# Altium schematic sheet FSR.SchDoc: Arm - Claw Sensor
size Letter; DrawnBy: N. Chapman, A. Ebrahim, K.Hong; Organization: UW Robotics; Address1: 200 University Avenue; Address2: Waterloo; Address3: Ontario; Address4: Canada N2L 3G6; SheetNumber: 7; SheetTotal: 9
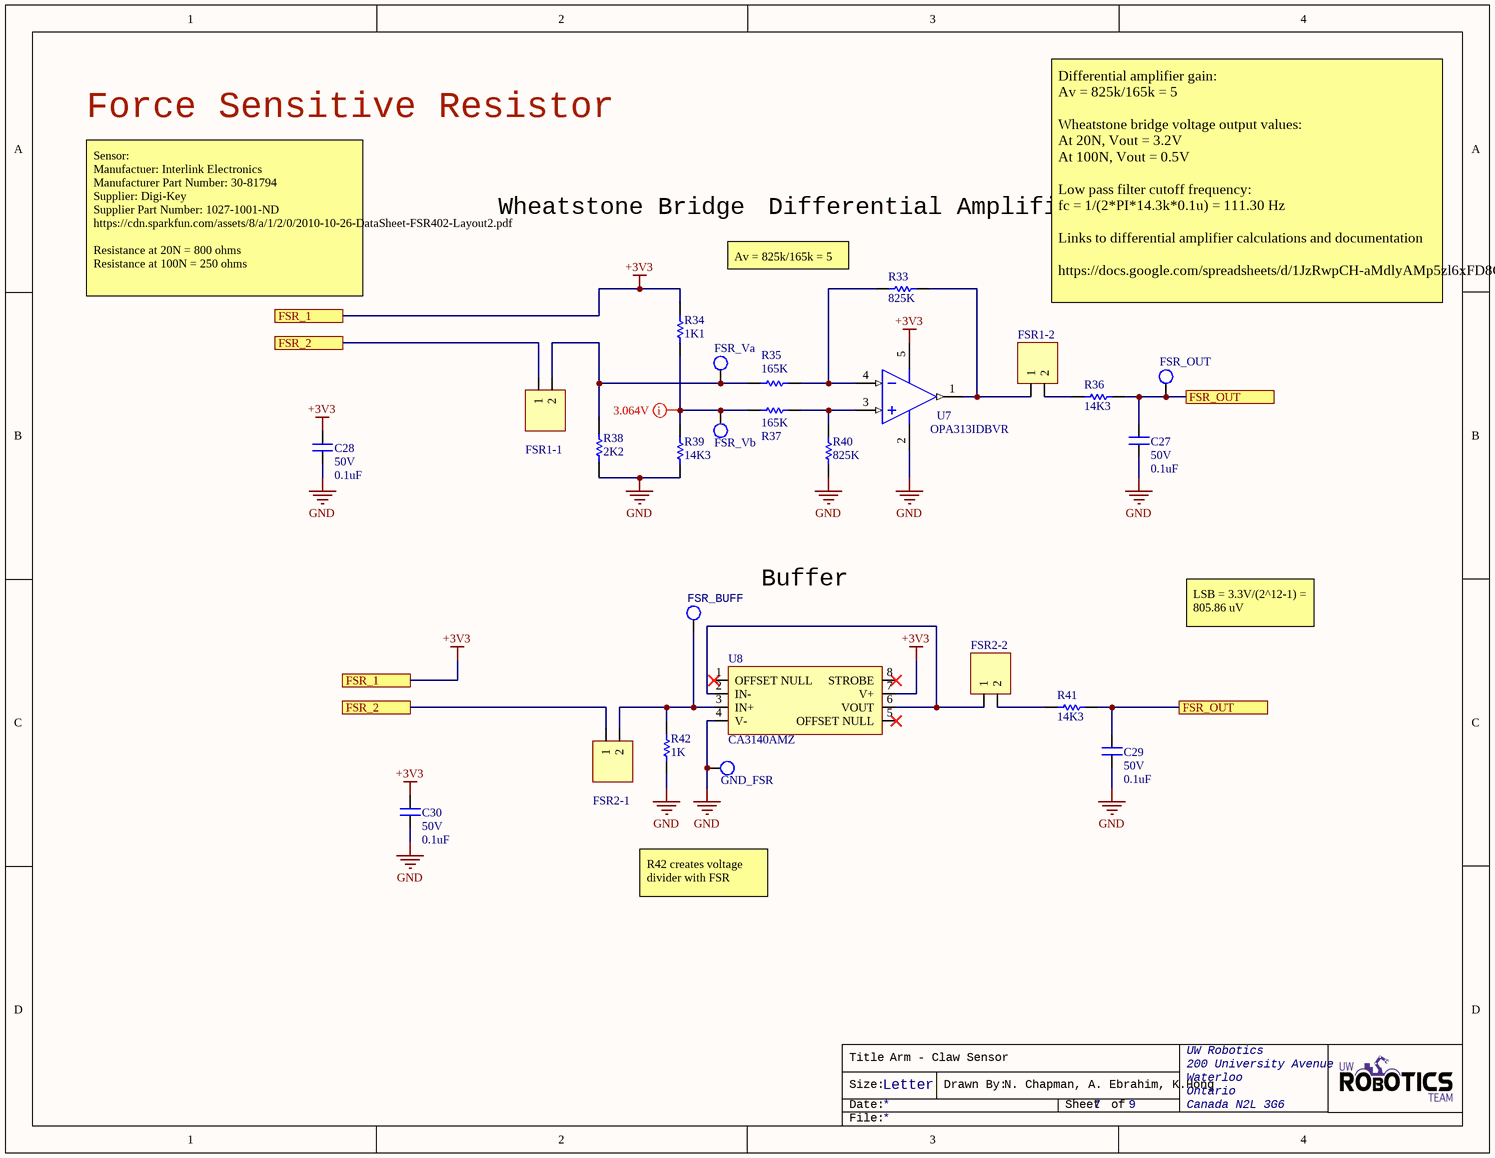
[diagram p0: FSR.SchDoc]

## Parts
C27  value 0.1uF  Voltage Rating: 50V  [CAPC0603(1608)55_N]  (hidden comment: CAP_0.1uF_50V_0603)
C28  value 0.1uF  Voltage Rating: 50V  [CAPC0603(1608)55_N]  (hidden comment: CAP_0.1uF_50V_0603)
C29  value 0.1uF  Voltage Rating: 50V  [CAPC0603(1608)55_N]  (hidden comment: CAP_0.1uF_50V_0603)
C30  value 0.1uF  Voltage Rating: 50V  [CAPC0603(1608)55_N]  (hidden comment: CAP_0.1uF_50V_0603)
FSR1-1  JUMPER_2  [HDR1X2]  (value not drawn)
FSR1-2  JUMPER_2  [HDR1X2]  (value not drawn)
FSR2-1  JUMPER_2  [HDR1X2]  (value not drawn)
FSR2-2  JUMPER_2  [HDR1X2]  (value not drawn)
FSR_BUFF  TESTPOINT_LOOP  [TESTPOINT_LOOP]  (value not drawn)
FSR_OUT  TESTPOINT_LOOP  [TESTPOINT_LOOP]  (value not drawn)
FSR_Va  TESTPOINT_LOOP  [TESTPOINT_LOOP]  (value not drawn)
FSR_Vb  TESTPOINT_LOOP  [TESTPOINT_LOOP]  (value not drawn)
GND_FSR  TESTPOINT_LOOP  [TESTPOINT_LOOP]  (value not drawn)
R33  value 825K  [RESC0603(1608)_N]  (hidden comment: RES_825K_0603)
R34  value 1K1  [RESC0603(1608)_N]  (hidden comment: 1.1K 1%)
R35  value 165K  [RESC0603(1608)_N]  (hidden comment: RES_165K_0603)
R36  value 14K3  [RESC0603(1608)_N]  (hidden comment: RES_14K3_0603)
R37  value 165K  [RESC0603(1608)_N]  (hidden comment: RES_165K_0603)
R38  value 2K2  [RESC0603(1608)_N]  (hidden comment: RES_2K2_0603)
R39  value 14K3  [RESC0603(1608)_N]  (hidden comment: 14.3K 1%)
R40  value 825K  [RESC0603(1608)_N]  (hidden comment: RES_825K_0603)
R41  value 14K3  [RESC0603(1608)_N]  (hidden comment: RES_14K3_0603)
R42  value 1K  [RESC0603(1608)_N]  (hidden comment: RES_1K_0603)
U7  OPA313IDBVR  [DBV0005A_M]
U8  CA3140AMZ  [CA3140AMZ]

## Ports
FSR_1, FSR_2, FSR_OUT

## Nets
+3V3: C28.2 C30.2 R34.2 U7.5(V+) U8.7(V+) ; port FSR_1
GND: C27.1 C28.1 C29.1 C30.1 GND_FSR.1 R38.1 R39.1 R40.1 R42.1 U7.2(V-) U8.4(V-)
FSR_2: FSR1-1.1 FSR2-1.1 ; port FSR_2
FSR_OUT: C27.2 C29.2 FSR_OUT.1 R36.2 R41.2 ; port FSR_OUT
NetFSR1-1_2: FSR1-1.2 FSR_Va.1 R35.1 R38.2
NetFSR1-2_1: FSR1-2.1 R33.2 U7.1(OUT)
NetFSR1-2_2: FSR1-2.2 R36.1
NetFSR2-1_2: FSR2-1.2 FSR_BUFF.1 R42.2 U8.3(IN+)
NetFSR2-2_1: FSR2-2.1 U8.2(IN-) U8.6(VOUT)
NetFSR2-2_2: FSR2-2.2 R41.1
NetFSR_Vb_1: FSR_Vb.1 R34.1 R37.1 R39.2
NetR33_1: R33.1 R35.2 U7.4(IN-)
NetR37_2: R37.2 R40.2 U7.3(IN+)

Not connected (* = marked no-connect by the designer): U8 1(OFFSET_NULL)* 5(OFFSET_NULL)* 8(STROBE)*

## Layout directives
mark named 3.064V: NetFSR_Vb_1

## Notes on the sheet
- Force Sensitive Resistor
- Wheatstone Bridge
- Differential Amplifier
- Sensor:
  Manufactuer: Interlink Electronics
  Manufacturer Part Number: 30-81794
  Supplier: Digi-Key
  Supplier Part Number: 1027-1001-ND
  https://cdn.sparkfun.com/assets/8/a/1/2/0/2010-10-26-DataSheet-FSR402-Layout2.pdf
  Resistance at 20N = 800 ohms
  Resistance at 100N = 250 ohms
- Av = 825k/165k = 5
- Differential amplifier gain:
  Av = 825k/165k = 5
  Wheatstone bridge voltage output values:
  At 20N, Vout = 3.2V
  At 100N, Vout = 0.5V
  Low pass filter cutoff frequency:
  fc = 1/(2*PI*14.3k*0.1u) = 111.30 Hz
  Links to differential amplifier calculations and documentation
  https://docs.google.com/spreadsheets/d/1JzRwpCH-aMdlyAMp5zl6xFD8GIuJzvmOR8Y5Kzd1RN0/edit#gid=0
- Buffer
- LSB = 3.3V/(2^12-1) = 805.86 uV
- R42 creates voltage divider with FSR
- Title
- Size:
- Date:
- Letter
- Drawn By:
- Sheet
- of
- File:

## Library data of the parts
C27-C30 = CAP_0.1uF_50V_0603: CAP CER 0.1UF 50V X7R 0603; MPN: CC0603KRX7R9BB104; Manufacturer: Yageo; Dimensions: 0.063" L x 0.031" W (1.60mm x 0.80mm); Package: 0603 (1608 Metric); Temperature Coefficient: X7R; Supplier Part Number 1: 311-1344-1-ND; Supplier 1: Digi-Key
FSR1-1 FSR1-2 FSR2-1 FSR2-2 = JUMPER_2: HEADER 2X1
FSR_BUFF FSR_OUT FSR_Va FSR_Vb GND_FSR = TESTPOINT_LOOP: Loop testpoint through-hole pad; Manufacturer: Keystone Electronics; Manufacturer Part Number 1: 5002; Supplier Part Number 1: 36-5002-ND; Supplier 1: Digi-Key
R33 R40 = RES_825K_0603: RES SMD 825K OHM 1% 1/10W 0603; Manufacturer: Yageo; MPN: RC0603FR-07825KL; Package: 0603 (1608 Metric); Dimensions: 0.063" L x 0.031" W (1.60mm x 0.80mm); Tolerance: 1%; Supplier Part Number 1: 311-825KHRCT-ND; Supplier 1: Digi-Key
R34 = RES_1K1_0603: RES SMD 1.1K OHM 1% 1/10W 0603; Manufacturer: Yageo; MPN: RC0603FR-071K1L; Dimensions: 0.063" L x 0.031" W (1.60mm x 0.80mm); Tolerance: 1%; Package: 0603 (1608 Metric); Supplier Part Number 1: 311-1.10KHRCT-ND; Supplier 1: Digi-Key
R35 R37 = RES_165K_0603: RES SMD 165K OHM 1% 1/10W 0603; Manufacturer: Yageo; MPN: RC0603FR-07165KL; Package: 0603 (1608 Metric); Dimensions: 0.063" L x 0.031" W (1.60mm x 0.80mm); Tolerance: 1%; Supplier Part Number 1: 311-165KHRCT-ND; Supplier 1: Digi-Key
R36 R39 R41 = RES_14K3_0603: RES SMD 14.3K OHM 1% 1/10W 0603; Manufacturer: Yageo; MPN: RC0603FR-0714K3L; Package: 0603 (1608 Metric); Dimensions: 0.063" L x 0.031" W (1.60mm x 0.80mm); Tolerance: 1%; Supplier Part Number 1: 311-14.3KHRCT-ND; Supplier 1: Digi-Key
R38 = RES_2K2_0603: RES SMD 2.2K OHM 1% 1/10W 0603; Manufacturer: Yageo; MPN: RC0603FR-072K2L; Dimensions: 0.063" L x 0.031" W (1.60mm x 0.80mm); Package: 0603 (1608 Metric); Tolerance: 1%; Supplier Part Number 1: 311-2.20KHRCT-ND; Supplier 1: Digi-Key
R42 = RES_1K_0603: RES SMD 1K OHM 5% 1/10W 0603; Manufacturer: Yageo; MPN: RC0603JR-071KL; Dimensions: 0.063" L x 0.031" W (1.60mm x 0.80mm); Tolerance: 5%; Package: 0603 (1608 Metric); Supplier Part Number 1: 311-1.0KGRCT-ND; Supplier 1: Digi-Key
U7 = OPAMP: IC OPAMP GP 1 CIRCUIT SOT23-5; Manufacturer: Texas Instruments; Offset Drift(Typ)(uV/C): 2; Rating: Catalog; Packing: LARGE T&R; SubFamily: Low Input Bias Current Amp (<=10pA), Low Power Amp (<=500uA); Number of Channels: 1; Eco-Plan: Green (RoHS & no Sb/Br); Vio (25C)(Max)(mV): 2.5; Total Supply Voltage(Min)(+5V is 5, +/-5V is 10): 1.8; CMRR(Min)(dB): 70; Total Supply Voltage(Max)(+5V is 5, +/-5V is 10): 5.5; Iq per channel(Max)(mA): 0.06; Slew Rate(Typ)(V/us): 0.5; ComponentLink1Description: Manufacturer URL; PackageVersion: 4073253-4/K, 03/2006; ComponentLink2Description: Datasheet; Code_JEDEC: MO-178; GBW(Typ)(MHz): 1; ComponentLink3Description: Package Specification; PartNumber: OPA313IDBVR; PackageReference: DBV0005A; Mounting Technology: Surface Mount; PackageDescription: 5-Pin Plastic Small Outline, Body 1.6 x 2.9 mm, Pitch 0.95 mm; ComponentLink1URL: http://www.ti.com/; DatasheetVersion: SBOS649C; ComponentLink2URL: http://www.ti.com/lit/ds/symlink/opa313.pdf; ComponentLink3URL: http://www.ti.com/litv/pdf/mpds018i; Supplier Part Number 1: 296-35607-1-ND; Supplier 1: Digi-Key
U8 = CA3140AMZ: IC OPAMP GP 1 CIRCUIT 8SOIC; Manufacturer: Renesas Electronics America Inc.; MPN: CA3140AMZ; Supplier Part Number 1: CA3140AMZ-ND; Supplier 1: Digi-Key